# Altium schematic sheet Cover_Page.SchDoc
size A2; DrawnBy: Hanif; DocumentNumber: 202205001; SheetNumber: 1; SheetTotal: 9
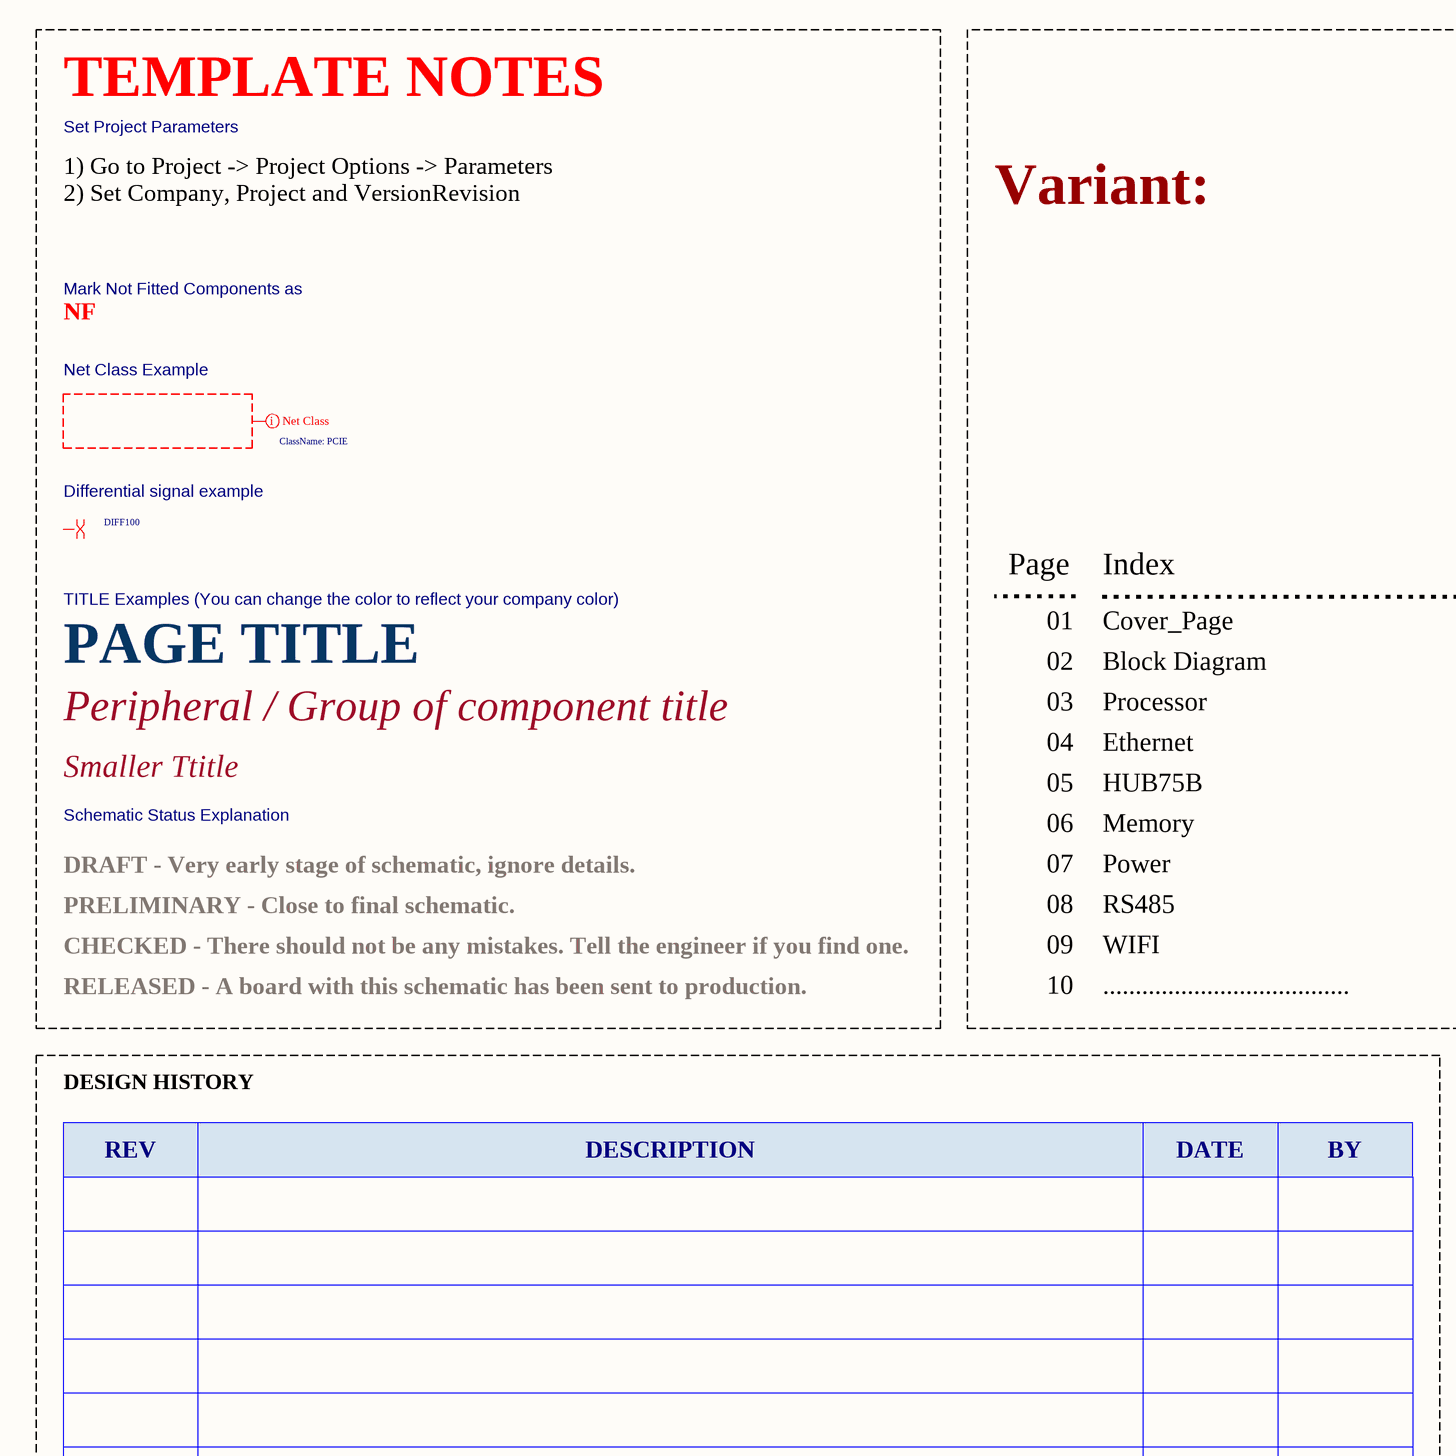
[diagram p0: Cover_Page.SchDoc, left]
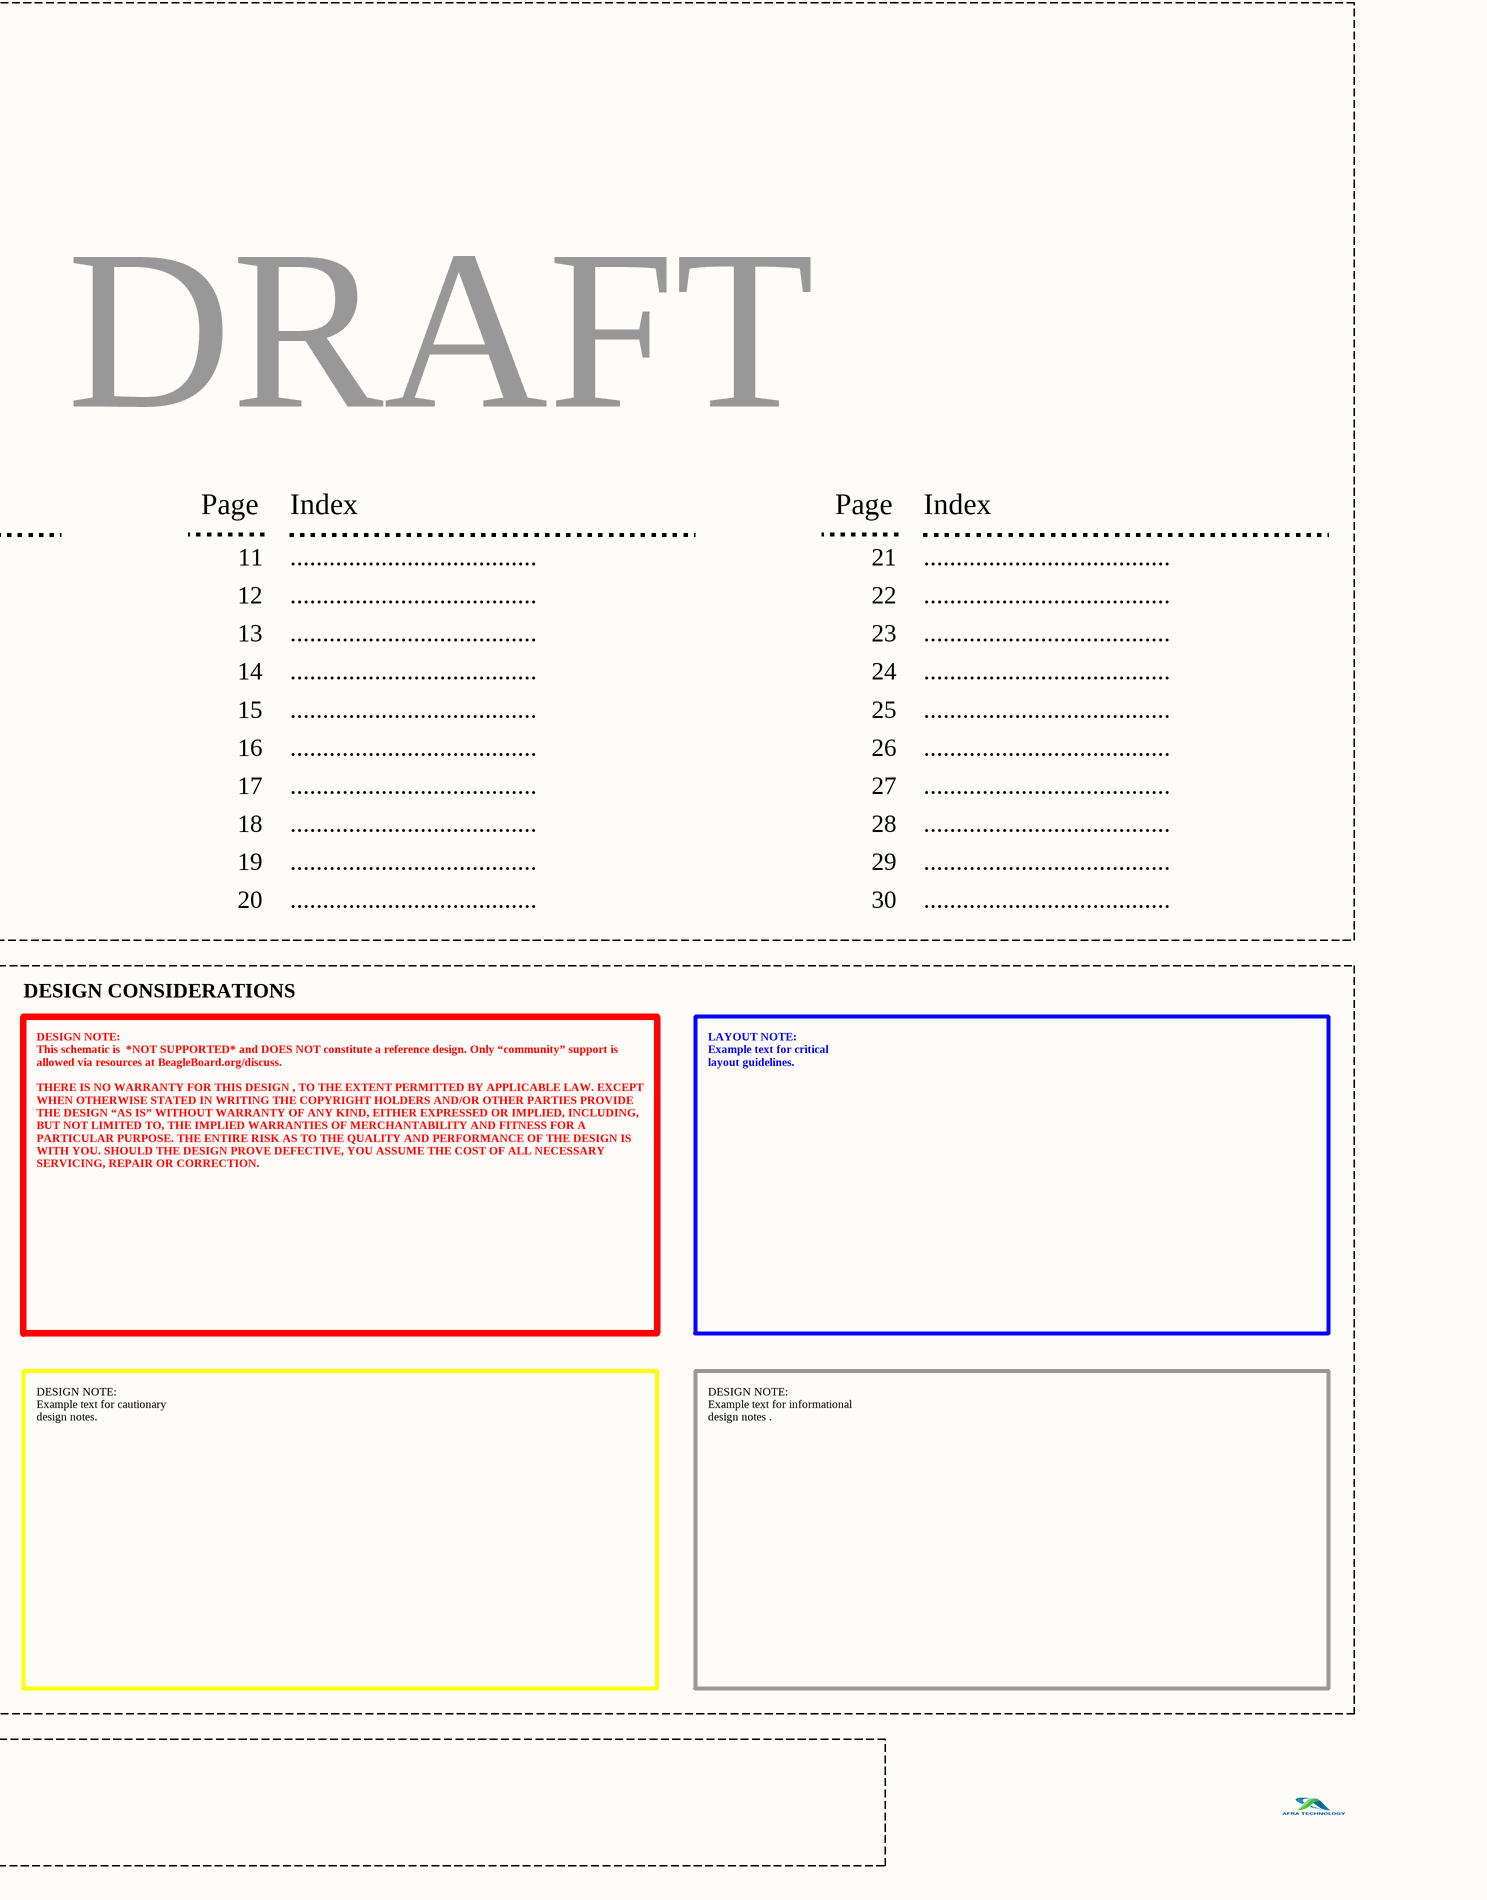
[diagram p1: Cover_Page.SchDoc, right]

## Layout directives
net class PCIE: (no net found under the mark)
differential pair; net class DIFF100: (no net found under the mark)

## Notes on the sheet
- Set Project Parameters
- TEMPLATE NOTES
- Variant:
- 1) Go to Project -> Project Options -> Parameters
  2) Set Company, Project and VersionRevision
- NF
- Mark Not Fitted Components as
- Net Class Example
- Differential signal example
- DRAFT
- TITLE Examples (You can change the color to reflect your company color)
- Page
- Index
- PAGE TITLE
- 01
- 02
- Cover_Page
- Block Diagram
- 11
- 12
- ......................................
- 21
- 22
- Peripheral / Group of component title
- 03
- 04
- Processor
- Ethernet
- 13
- 14
- 23
- 24
- Schematic Status Explanation
- Smaller Ttitle
- 05
- HUB75B
- 15
- 25
- DRAFT - Very early stage of schematic, ignore details.
- 06
- 07
- Memory
- Power
- 16
- 17
- 26
- 27
- PRELIMINARY - Close to final schematic.
- CHECKED - There should not be any mistakes. Tell the engineer if you find one.
- 08
- 09
- RS485
- WIFI
- 18
- 19
- 28
- 29
- RELEASED - A board with this schematic has been sent to production.
- 10
- 20
- 30
- DESIGN HISTORY
- DESIGN CONSIDERATIONS
- REV
- DESCRIPTION
- DATE
- BY
- DESIGN NOTE:
  This schematic is  *NOT SUPPORTED* and DOES NOT constitute a reference design. Only “community” support is allowed via resources at BeagleBoard.org/discuss.
  THERE IS NO WARRANTY FOR THIS DESIGN , TO THE EXTENT PERMITTED BY APPLICABLE LAW. EXCEPT WHEN OTHERWISE STATED IN WRITING THE COPYRIGHT HOLDERS AND/OR OTHER PARTIES PROVIDE THE DESIGN “AS IS” WITHOUT WARRANTY OF ANY KIND, EITHER EXPRESSED OR IMPLIED, INCLUDING, BUT NOT LIMITED TO, THE IMPLIED WARRANTIES OF MERCHANTABILITY AND FITNESS FOR A PARTICULAR PURPOSE. THE ENTIRE RISK AS TO THE QUALITY AND PERFORMANCE OF THE DESIGN IS WITH YOU. SHOULD THE DESIGN PROVE DEFECTIVE, YOU ASSUME THE COST OF ALL NECESSARY SERVICING, REPAIR OR CORRECTION.
- LAYOUT NOTE:
  Example text for critical
  layout guidelines.
- DESIGN NOTE:
  Example text for cautionary
  design notes.
- DESIGN NOTE:
  Example text for informational
  design notes .
- CONFIDENTAL. Do not distribute.
- Page Contents:
- Title:
- Company
- Logo
- Date:
- SIZE:
- A2
- DWG Num:
- Time:
- Sheet
- Revision:
- of
- Drawn by:
- Checked by: